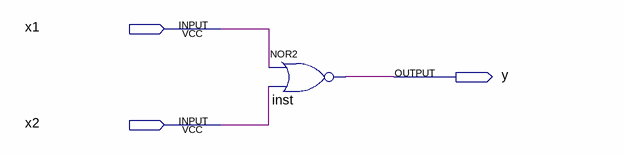
[diagram p0: schematic sheet]
// Quartus schematic lab14.bdf as structural Verilog: 1 symbols, 3 pins
module lab14 (
  input  x1,
  input  x2,
  output y
);

  nor inst (y, x1, x2);
endmodule
